# Altium schematic sheet [07] - GIGAVAC.SchDoc: GIGAVAC
size 433 x 279 mm; Author: ZAG; DrawnBy: ZAG; DocumentNumber: 5; SheetNumber: 7; SheetTotal: 8; PageSetup: Record=PageOptions|CenterHorizontal=True|CenterVertical=True|PrintScale=0.96|XCorrection=1.00|YCorrection=1.00|PrintKind=2|BorderSize=5000000|LeftOffset=0|BottomOffset=0|Orientation=2|PaperLength=4318|PaperWidth=2794|Scale=100|PaperSource=15|PrintQuality=600|MediaType=1|DitherType=10|PaperKind=11x17|PrintScaleMode=1; PCBRevision: 01; SchRevision: 01; Project: VAN BATT CTRLR V1; SchStatus: PRELIM
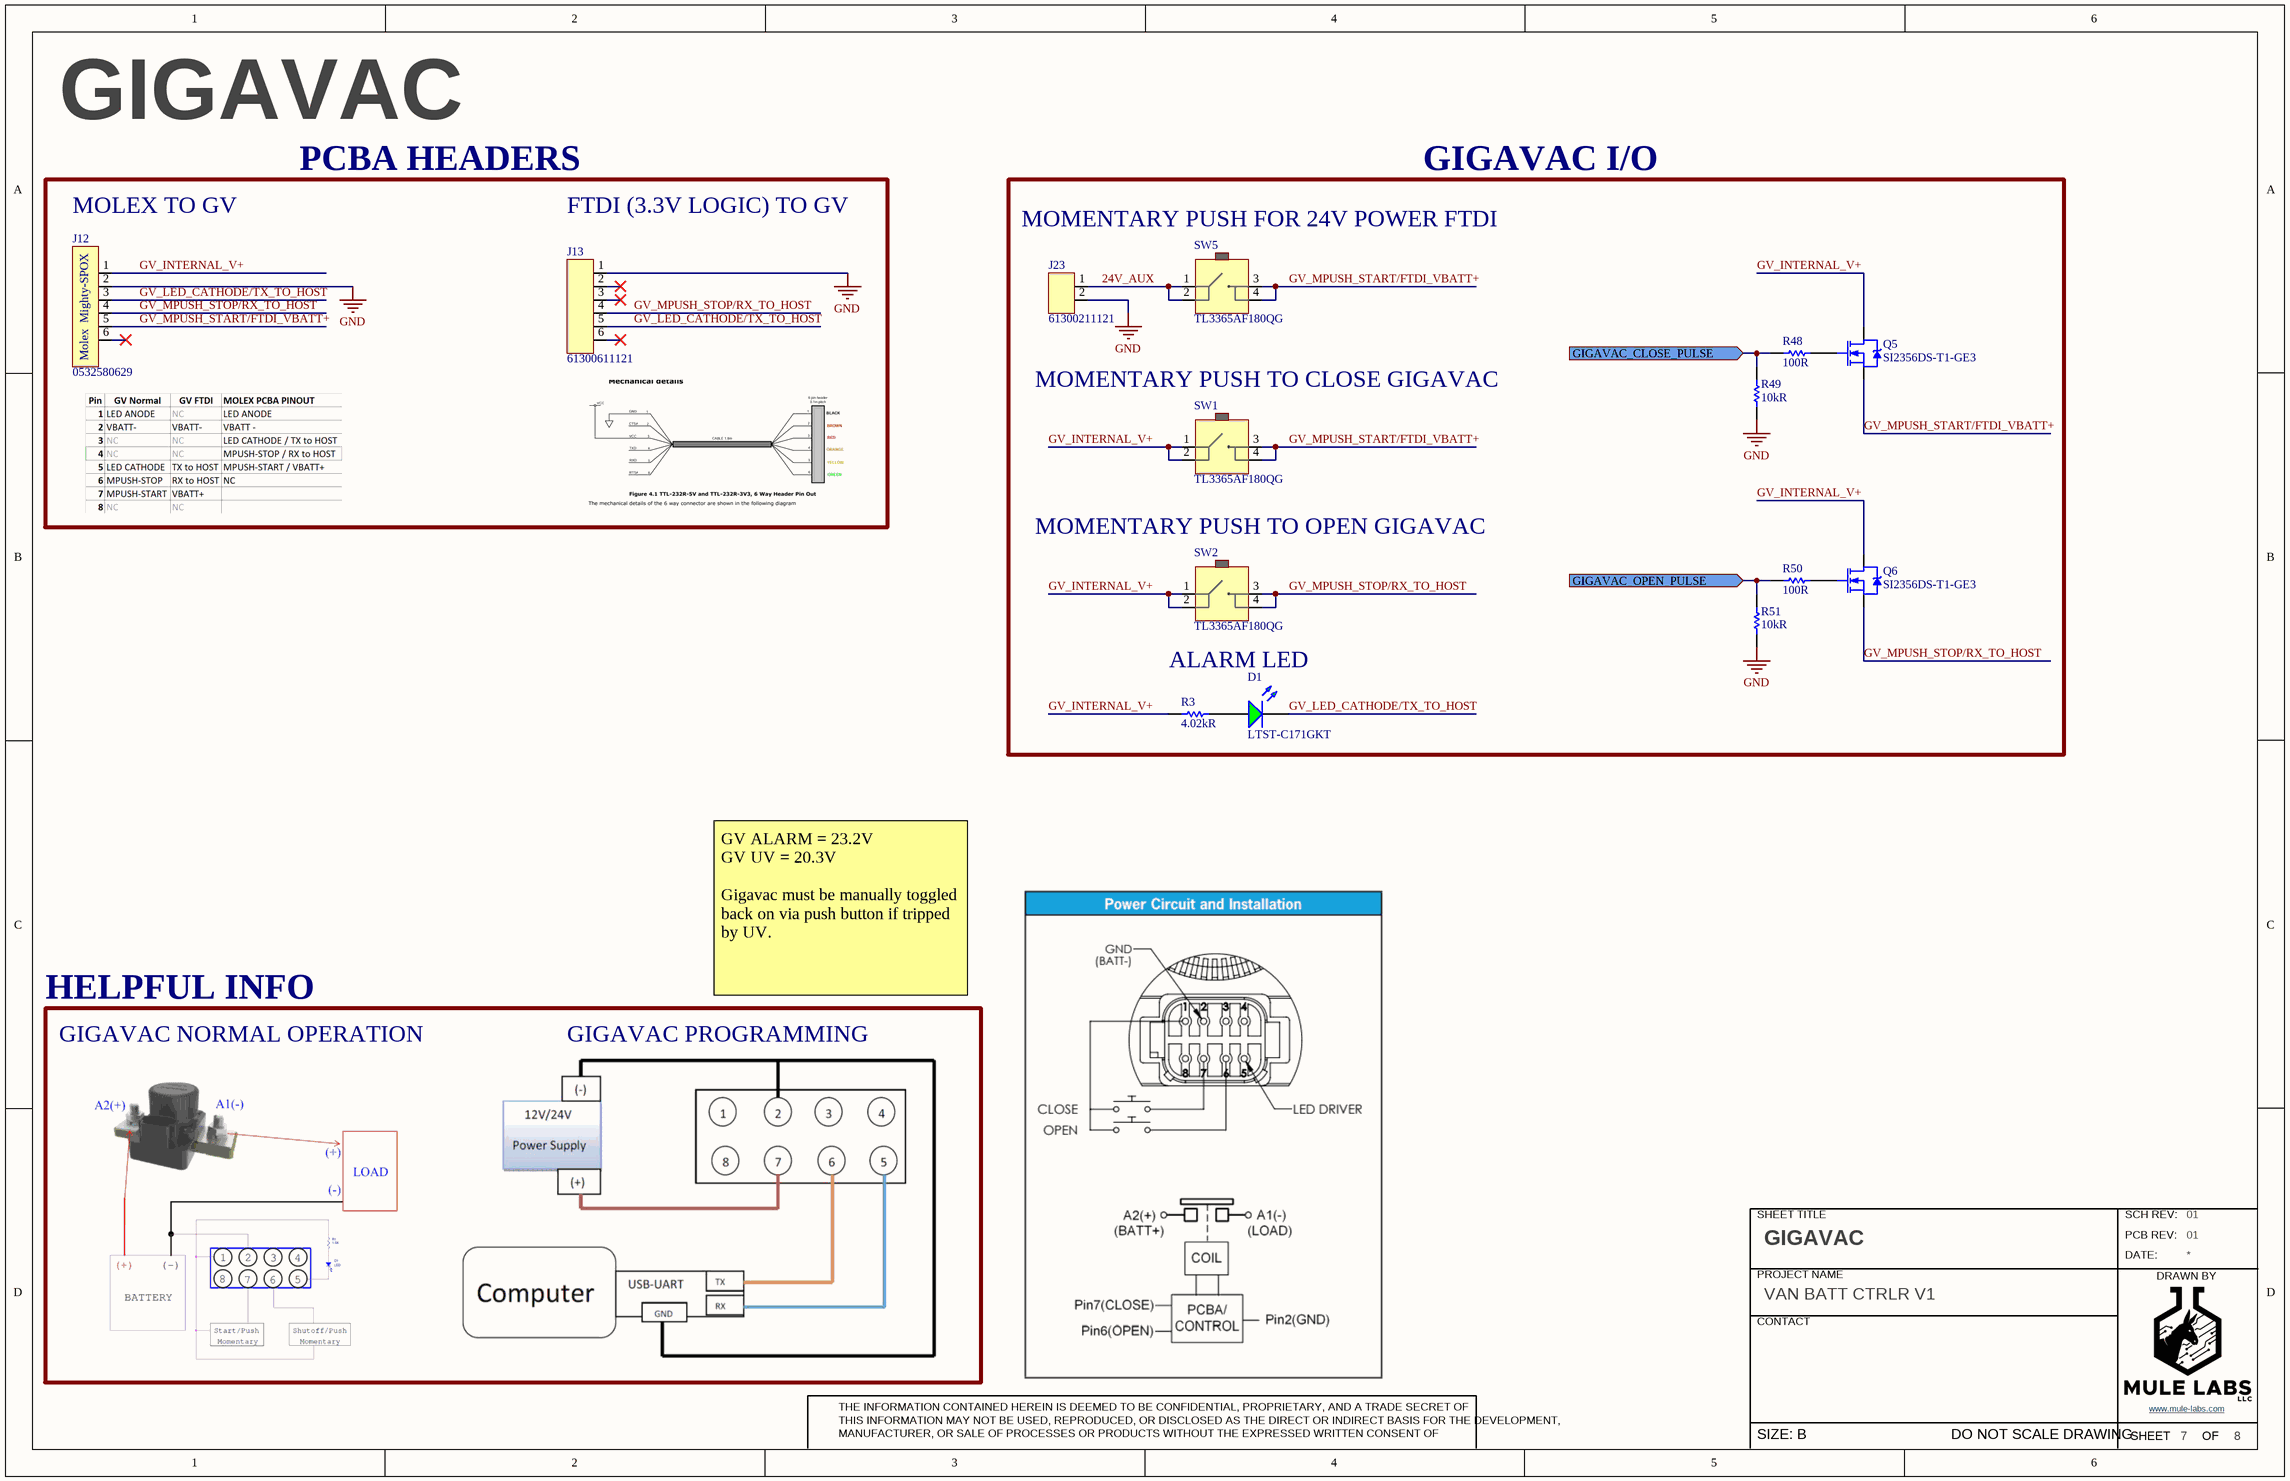
[diagram p0: [07] - GIGAVAC.SchDoc]

## Parts
D1  LTST-C171GKT  [LED - 0805 - GREEN]
J12  0532580629  [MOLEX_532580629]
J13  61300611121  [WURTH_61300611121]
J23  61300211121  [WURTH_61300211121]
Q5  SI2356DS-T1-GE3  [SOT23-3P95_237X112L50X42N]
Q6  SI2356DS-T1-GE3  [SOT23-3P95_237X112L50X42N]
R3  4.02kR  [INCH 0805 - METRIC 2012 - H065]
R48  100R  [INCH 0603 - METRIC 1608 - H055]
R49  10kR  [INCH 0603 - METRIC 1508 - H050]
R50  100R  [INCH 0603 - METRIC 1608 - H055]
R51  10kR  [INCH 0603 - METRIC 1508 - H050]
SW1  TL3365AF180QG  [ESWITCH_TL3365AF180QG]
SW2  TL3365AF180QG  [ESWITCH_TL3365AF180QG]
SW5  TL3365AF180QG  [ESWITCH_TL3365AF180QG]

## Blocks framed on the sheet
PCBA HEADERS: J12 J13
GIGAVAC I/O: D1 J23 Q5 Q6 R3 R48-R51 SW1 SW2 SW5

## Ports
GIGAVAC_CLOSE_PULSE (in), GIGAVAC_OPEN_PULSE (in)

## Nets
GND: J12.2 J13.1 J23.2 R49.1 R51.1
24V_AUX: J23.1 SW5.1 SW5.2
GIGAVAC_CLOSE_PULSE: R48.1 R49.2 ; port GIGAVAC_CLOSE_PULSE
GIGAVAC_OPEN_PULSE: R50.1 R51.2 ; port GIGAVAC_OPEN_PULSE
GV_INTERNAL_V+: J12.1 Q5.3(D) Q6.3(D) R3.1 SW1.1 SW1.2 SW2.1 SW2.2
GV_LED_CATHODE/TX_TO_HOST: D1.C J12.3 J13.5
GV_MPUSH_START/FTDI_VBATT+: J12.5 Q5.2(S) SW1.3 SW1.4 SW5.3 SW5.4
GV_MPUSH_STOP/RX_TO_HOST: J12.4 J13.4 Q6.2(S) SW2.3 SW2.4
NetD1_A: D1.A R3.2
NetQ5_1: Q5.1(G) R48.2
NetQ6_1: Q6.1(G) R50.2

Not connected (* = marked no-connect by the designer): J12 6*; J13 2* 3* 6*

## Notes on the sheet
- MOLEX TO GV
- FTDI (3.3V LOGIC) TO GV
- MOMENTARY PUSH FOR 24V POWER FTDI
- MOMENTARY PUSH TO CLOSE GIGAVAC
- MOMENTARY PUSH TO OPEN GIGAVAC
- ALARM LED
- HELPFUL INFO
- GV ALARM = 23.2V
  GV UV = 20.3V
  Gigavac must be manually toggled back on via push button if tripped by UV.
- GIGAVAC NORMAL OPERATION
- GIGAVAC PROGRAMMING
- SHEET TITLE
- SCH REV:
- PROJECT NAME
- PCB REV:
- DATE:
- DRAWN BY
- CONTACT
- MANUFACTURER, OR SALE OF PROCESSES OR PRODUCTS WITHOUT THE EXPRESSED WRITTEN CONSENT OF
- THE INFORMATION CONTAINED HEREIN IS DEEMED TO BE CONFIDENTIAL, PROPRIETARY, AND A TRADE SECRET OF
- THIS INFORMATION MAY NOT BE USED, REPRODUCED, OR DISCLOSED AS THE DIRECT OR INDIRECT BASIS FOR THE DEVELOPMENT,
- SHEET
- www.mule-labs.com <http://www.mule-labs.com>
- OF
- SIZE: B
- DO NOT SCALE DRAWING
- (in symbol 0532580629) Molex  Mighty-SPOX

## Library data of the parts
D1 = LTST-C171GKT: Lite-On LTST-C171GKT, CHIPLED 0805 Series Green LED, 569 nm 2012 (0805), Rectangle Lens SMD package; Manufacturer: Vishay Lite-On; Lens Colour: Clear,Colorless; Viewing Angle: 130°; Lens Style: Clear,Diffused,Colorless,Rectangular; Luminous Intensity: 12mcd; Forward Current: 30mA; Forward Voltage: 2.1V; Power Rating: 100mW; Dominant Wavelength: 569nm; Test Current: 10mA; Lens Transparency: Clear; Number of Elements: 1; Wavelength: 585nm; Reverse Voltage: 5V; Supplier 1: Digi-Key; Manufacturer Part Number: LTST-C171GKT; Stock 1: 271428; Pricing 1: 1=0.29, 10=0.211, 25=0.1556, 100=0.1111, 250=0.07556, 500=0.06666, 1000=0.05222 (USD); Mount: Surface Mount; Case/Package: 0805; Number of Pins: 2; Color: Green; Case Code (Metric): 2012; Case Code (Imperial): 0805; Min Operating Temperature: -55°C; Max Operating Temperature: 85°C; Package Quantity: 1; Packaging: Tape and Reel; Illumination Colour: Green; Power Dissipation: 100mW; Number of LEDs: 1; Length: 2mm; Height: 0.8mm; Width: 1.25mm; Depth: 1.25mm; Radiation Hardening: No; Lead Free: Lead Free; ComponentLink1URL: https://datasheet.ciiva.com/2110/ltst-c171gkt-2110000.pdf; ComponentLink1Description: https://datasheet.ciiva.com/2110/ltst-c171gkt-2110000.pdf; ComponentLink2URL: https://datasheet.ciiva.com/2110/ltst-c171gkt-2110001.pdf; ComponentLink2Description: https://datasheet.ciiva.com/2110/ltst-c171gkt-2110001.pdf; ComponentLink3URL: https://datasheet.ciiva.com/2110/ltst-c171gkt-2110002.pdf; ComponentLink3Description: https://datasheet.ciiva.com/2110/ltst-c171gkt-2110002.pdf; ComponentLink4URL: https://datasheet.ciiva.com/16396/ltst-c171gkt-16396549.pdf; ComponentLink4Description: https://datasheet.ciiva.com/16396/ltst-c171gkt-16396549.pdf; ComponentLink5URL: https://datasheet.ciiva.com/11773/0900766b80dc0296-11773991.pdf; ComponentLink5Description: https://datasheet.ciiva.com/11773/0900766b80dc0296-11773991.pdf; ComponentLink6URL: https://datasheet.ciiva.com/12400/lite-on-ltst-c171gkt-190133-12400647.pdf; ComponentLink6Description: https://datasheet.ciiva.com/12400/lite-on-ltst-c171gkt-190133-12400647.pdf; Supplier Part Number 1: 160-1423-1-ND; Category: LED
J12 = 0532580629: Mighty-SPOX Header, 3.50mm Pitch, Vertical, 6 Circuits, Brass (CuZn) Contact; Manufacturer: Molex; Contact Resistance: 10mR; Number of Positions: 6; Max Voltage Rating (AC): 250V; Connector Type: Male Pin; Pitch: 3.5mm; Supplier 1: Digi-Key; Manufacturer Part Number: 0532580629; RoHS: Yes; Category: Headers and Wire Housings; Stock 1: 6430; Pricing 1: 1=1.47000, 10=1.25600, 80=1.03738, 945=0.81901, 4900=0.72800 (USD); Mount: Through Hole; Contact Plating: Tin,Copper; Contact Material: Brass; Housing Material: Polyester; Color: Natural; Housing Color: Natural; Min Operating Temperature: -40°C; Max Operating Temperature: 105°C; Number of Rows: 1; Packaging: Tray; Termination: Solder; Number of Contacts: 6; Orientation: Straight; Series: 53258; Fastening Type: Latch; Contact Type: Male Pin; Length: 23.1mm; Radiation Hardening: No; Lead Free: Lead Free; ComponentLink1URL: https://datasheet.ciiva.com/737/532580229-sd-737999.pdf?src-supplier=Digi-Key; ComponentLink1Description: https://datasheet.ciiva.com/737/532580229-sd-737999.pdf?src-supplier=Digi-Key; ComponentLink2URL: https://datasheet.ciiva.com/10086/0532580629-pcb-headers-10086507.pdf?src-supplier=Avnet; ComponentLink2Description: https://datasheet.ciiva.com/10086/0532580629-pcb-headers-10086507.pdf?src-supplier=Avnet; Supplier Part Number 1: WM3416-ND
J13 = 61300611121: CONN HEADER 6 POS 2.54; Manufacturer: Wurth Electronics; Current Rating: 3A; Voltage Rating: 250V; Number of Positions: 6; Gender: Male; Connector Type: Male Pin; Pitch: 0.1inch; Supplier 1: Digi-Key; Manufacturer Part Number: 61300611121; Stock 1: 22694; Pricing 1: 1=0.33, 10=0.279, 25=0.232, 50=0.194, 100=0.176, 1000=0.16 (USD); Mount: Through Hole; Contact Plating: Gold; Contact Material: Copper,Copper Alloy; Housing Material: PBT; Color: Black; Min Operating Temperature: -40°C; Max Operating Temperature: 125°C; Number of Rows: 1; Contact Gender: Male; Packaging: Bulk; Termination: Through Hole; Number of Contacts: 6; Contact Mating Length: 0.236inch; REACH SVHC: Unknown; Lead Free: Lead Free; Supplier Part Number 1: 732-5319-ND
J23 = 61300211121: CONN HEADER 2 POS 2.54; Manufacturer: Wurth Electronics; Current Rating: 3A; Voltage Rating: 250V; Number of Positions: 2; Gender: Male; Connector Type: Male Pin; Pitch: 0.1inch; Supplier 1: Digi-Key; Manufacturer Part Number: 61300211121; Stock 1: 260997; Pricing 1: 1=0.13, 10=0.106, 25=0.088, 50=0.074, 100=0.067, 1000=0.061 (USD); Mount: Through Hole; Contact Plating: Gold; Housing Material: PBT; Contact Material: Copper,Copper Alloy; Colour: Black; Min Operating Temperature: -40°C; Max Operating Temperature: 125°C; Number of Rows: 1; Contact Gender: Male; Packaging: Bulk; Termination: Through Hole; Number of Contacts: 2; Contact Mating Length: 0.236inch; REACH SVHC: Unknown; Lead Free: Lead Free; ComponentLink1URL: http://www.mouser.com/ds/2/445/6130xx11121-538006.pdf; ComponentLink1Description: http://www.mouser.com/ds/2/445/6130xx11121-538006.pdf; Supplier Part Number 1: 732-5315-ND
Q5 Q6 = SI2356DS-T1-GE3: Si2356DS Series 40 V 3.2 A 51 mOhm Surface Mount N-Channel Mosfet - SOT-23-3; Manufacturer: Vishay Siliconix; Rds On Max: 51mR; Input Capacitance: 370pF; Rise Time: 52ns; Drain to Source Voltage (Vdss): 40V; Continuous Drain Current (ID): 4.3A; Max Power Dissipation: 1.7W; Gate to Source Voltage (Vgs): 12V; Drain to Source Resistance: 56mR; Fall Time: 53ns; Turn-Off Delay Time: 18ns; Threshold Voltage: 1.5V; Element Configuration: Single; Number of Channels: 1; Turn-On Delay Time: 10ns; Supplier 1: Digi-Key; Manufacturer Part Number: SI2356DS-T1-GE3; RoHS: Yes; Category: MOSFETs; Stock 1: 50; Pricing 1: 1=0.42000, 10=0.34200, 100=0.23300, 500=0.17476, 1000=0.13108 (USD); Mount: Surface Mount; Case/Package: TO-236-3; Number of Pins: 3; Weight: 0.050717oz; Min Operating Temperature: -55°C; Max Operating Temperature: 150°C; Packaging: Tape and Reel; Package Quantity: 3000; Drain to Source Breakdown Voltage: 40V; REACH SVHC: No SVHC; Lead Free: Lead Free; RoHS Compliant: Yes; ComponentLink1URL: https://datasheet.ciiva.com/29755/si2356ds-29755664.pdf?src-supplier=Digi-Key; ComponentLink1Description: https://datasheet.ciiva.com/29755/si2356ds-29755664.pdf?src-supplier=Digi-Key; ComponentLink2URL: https://datasheet.ciiva.com/24111/si2356ds-268760-24111179.pdf?src-supplier=Mouser; ComponentLink2Description: https://datasheet.ciiva.com/24111/si2356ds-268760-24111179.pdf?src-supplier=Mouser; ComponentLink3URL: https://datasheet.ciiva.com/29755/si2356ds-29755653.pdf?src-supplier=Digi-Key; ComponentLink3Description: https://datasheet.ciiva.com/29755/si2356ds-29755653.pdf?src-supplier=Digi-Key; ComponentLink4URL: https://datasheet.ciiva.com/29755/si2356ds-29755658.pdf?src-supplier=Digi-Key; ComponentLink4Description: https://datasheet.ciiva.com/29755/si2356ds-29755658.pdf?src-supplier=Digi-Key; Supplier Part Number 1: SI2356DS-T1-GE3CT-ND
R3 = RMCF0805FT4K02: RES 4.02K OHM 1% 1/8W 0805; Manufacturer: Stackpole Electronics; Max Power Dissipation: 125mW; Temperature Coefficient: 100ppm/°C; Supplier 1: Digi-Key; Manufacturer Part Number: RMCF0805FT4K02; RoHS: Yes; Category: Chip SMD Resistors; Stock 1: 219640; Pricing 1: 1=0.10000, 10=0.02500, 100=0.01000, 1000=0.00449, 2500=0.00390 (USD); Mount: Surface Mount; Case/Package: 0805; Case Code (Metric): 2012; Case Code (Imperial): 0805; Contact Plating: Tin,Matte; Min Operating Temperature: -55°C; Max Operating Temperature: 155°C; Resistance: 4.02kR; Tolerance: 1%; Packaging: Tape and Reel; Resistor Type: Thick Film; Number of Terminations: 2; Features: Automotive AEC-Q200; Series: RMCF; Length: 0.079inch; Width: 0.049inch; Height: 0.026inch; Radiation Hardening: No; RoHS Compliant: Yes; ComponentLink1URL: http://components.arrow.com/part/dataview/44988052S7077149N1174?src-supplier=Arrow+Electronics; ComponentLink1Description: http://components.arrow.com/part/dataview/44988052S7077149N1174?src-supplier=Arrow+Electronics; ComponentLink2URL: https://www.seielect.com/catalog/SEI-RMCF_RMCP.pdf?src-supplier=Avnet; ComponentLink2Description: https://www.seielect.com/catalog/SEI-RMCF_RMCP.pdf?src-supplier=Avnet; ComponentLink3URL: https://www.seielect.com/catalog/SEI-Packaging.pdf?src-supplier=Digi-Key; ComponentLink3Description: https://www.seielect.com/catalog/SEI-Packaging.pdf?src-supplier=Digi-Key; ComponentLink4URL: https://www.seielect.com/Catalog/SEI-RMCF_RMCP.pdf?src-supplier=Digi-Key; ComponentLink4Description: https://www.seielect.com/Catalog/SEI-RMCF_RMCP.pdf?src-supplier=Digi-Key; Supplier Part Number 1: RMCF0805FT4K02DKR-ND
R48 R50 = CPF0603B100RE1: RES SMD 100 OHM 0.1% 1/16W 0603; Manufacturer: TE Connectivity Neohm; Temperature Coefficient: 25ppm/°C; Power Rating: 63mW; Voltage Rating: 50V; Number of Resistors: 1; Supplier 1: Digi-Key; Manufacturer Part Number: CPF0603B100RE1; RoHS: Yes; Category: Chip SMD Resistors; Stock: 7060; Pricing: 1=0.65000, 10=0.46300, 100=0.24080 (USD); Mount: Surface Mount; Case/Package: 0603; Number of Pins: 2; Weight: 7.1E-05oz; Case Code (Imperial): 0603; Case Code (Metric): 1608; Min Operating Temperature: -55°C; Max Operating Temperature: 155°C; Resistance: 100R; Tolerance: 0.1%; Packaging: Tape and Reel; Package Quantity: 1000; Composition: Thin Film; Number of Terminations: 2; Termination: Solder; Voltage Rating (DC): 50V; Length: 1.55mm; Height: 0.45mm; Width: 0.8mm; REACH SVHC: No SVHC; ELV: Compliant; ComponentLink1URL: https://datasheet.ciiva.com/6767/1652074-6767153.pdf?src-supplier=Newark; ComponentLink1Description: https://datasheet.ciiva.com/6767/1652074-6767153.pdf?src-supplier=Newark; ComponentLink2URL: https://datasheet.ciiva.com/6116/eng-ds-1773200-j-6116235.pdf?src-supplier=Farnell; ComponentLink2Description: https://datasheet.ciiva.com/6116/eng-ds-1773200-j-6116235.pdf?src-supplier=Farnell; ComponentLink3URL: https://datasheet.ciiva.com/12834/eng-ds-1773200-i-12834812.pdf?src-supplier=Mouser; ComponentLink3Description: https://datasheet.ciiva.com/12834/eng-ds-1773200-i-12834812.pdf?src-supplier=Mouser; Supplier Part Number 1: A102330CT-ND
R49 R51 = RR0816P-103-D: RES SMD 10K OHM 0.5% 1/16W 0603; Manufacturer: Susumu; Power Rating: 63mW; Voltage Rating: 75V; Temperature Coefficient: 25ppm/°C; Supplier 1: Digi-Key; Manufacturer Part Number: RR0816P-103-D; Stock 1: 1106095; Pricing 1: 1=0.11, 10=0.098, 100=0.0376, 1000=0.01654, 2500=0.01428 (USD); Case/Package: 0603; Number of Pins: 2; Weight: 7.1E-05oz; Case Code (Imperial): 0603; Case Code (Metric): 1608; Min Operating Temperature: -55°C; Max Operating Temperature: 125°C; Packaging: Tape and Reel; Resistance: 10kR; Tolerance: 0.5%; Package Quantity: 1; Termination: SMD/SMT; Composition: Thin Film; Number of Terminations: 2; Max Power Dissipation: 63mW; Voltage Rating (DC): 75V; Length: 1.6mm; Height: 0.4mm; Width: 0.8mm; Depth: 0.8mm; REACH SVHC: Unknown; Lead Free: Lead Free; ComponentLink1URL: https://datasheet.ciiva.com/11820/0900766b80808d64-11820656.pdf; ComponentLink1Description: https://datasheet.ciiva.com/11820/0900766b80808d64-11820656.pdf; ComponentLink2URL: https://datasheet.ciiva.com/2487/rr-data-sheet-2487034.pdf; ComponentLink2Description: https://datasheet.ciiva.com/2487/rr-data-sheet-2487034.pdf; ComponentLink3URL: https://datasheet.ciiva.com/2487/rr-data-sheet-2487035.pdf; ComponentLink3Description: https://datasheet.ciiva.com/2487/rr-data-sheet-2487035.pdf; ComponentLink4URL: https://datasheet.ciiva.com/2487/rr-data-sheet-2487036.pdf; ComponentLink4Description: https://datasheet.ciiva.com/2487/rr-data-sheet-2487036.pdf; Supplier Part Number 1: RR08P10.0KDCT-ND; Category: Resistor
SW1 SW2 SW5 = TL3365AF180QG: SWITCH TACTILE SPST-NO 0.05A 12V; Manufacturer: E-Switch; Mechanical Life: 100000Cycles; Illumination Type: Non-Illuminated; Operating Force: 180gf; Throw Configuration: SPST; Switch Travel: 0.2mm; Switch Function: Off-Mom; Supplier 1: Digi-Key; Manufacturer Part Number: TL3365AF180QG; Stock 1: 55347; Pricing 1: 1=0.34, 10=0.333, 25=0.3208, 50=0.3088, 100=0.297, 250=0.27324, 500=0.2376, 1000=0.20196 (USD); Mount: Surface Mount; Min Operating Temperature: -20°C; Max Operating Temperature: 70°C; Packaging: Tape and Reel; Termination: Gull Wing; Lead Free: Lead Free; Supplier Part Number 1: EG5384CT-ND